# EAGLE design snes_ext_port_adapter (EAGLE 6.4)
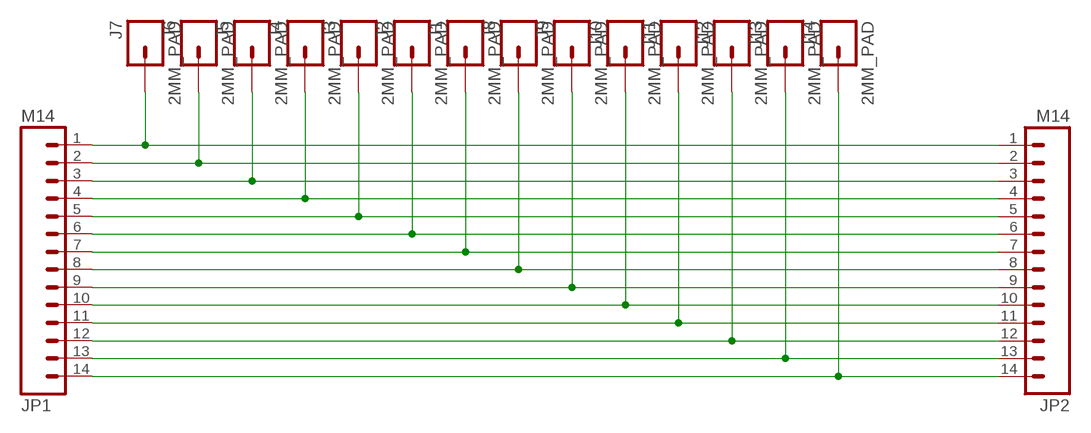
[diagram p0: schematic, sheet 1]

## Parts
J1  2MM_PAD  [1MM_PAD]
J2  2MM_PAD  [1MM_PAD]
J3  2MM_PAD  [1MM_PAD]
J4  2MM_PAD  [1MM_PAD]
J5  2MM_PAD  [1MM_PAD]
J6  2MM_PAD  [1MM_PAD]
J7  2MM_PAD  [1MM_PAD]
J8  2MM_PAD  [1MM_PAD]
J9  2MM_PAD  [1MM_PAD]
J10  2MM_PAD  [1MM_PAD]
J11  2MM_PAD  [1MM_PAD]
J12  2MM_PAD  [1MM_PAD]
J13  2MM_PAD  [1MM_PAD]
J14  2MM_PAD  [1MM_PAD]
JP1  M14  [1X14]
JP2  M14  [1X14]

## Nets
N$1: J7.P$1 JP1.1 JP2.1
N$2: J6.P$1 JP1.2 JP2.2
N$3: J5.P$1 JP1.3 JP2.3
N$4: J4.P$1 JP1.4 JP2.4
N$5: J3.P$1 JP1.5 JP2.5
N$6: J2.P$1 JP1.6 JP2.6
N$7: J1.P$1 JP1.7 JP2.7
N$8: J8.P$1 JP1.8 JP2.8
N$9: J9.P$1 JP1.9 JP2.9
N$10: J10.P$1 JP1.10 JP2.10
N$11: J11.P$1 JP1.11 JP2.11
N$12: J12.P$1 JP1.12 JP2.12
N$13: J13.P$1 JP1.13 JP2.13
N$14: J14.P$1 JP1.14 JP2.14

## Library data of the parts
J1-J14 = TASLink:2MM_PAD
JP1 JP2 = SparkFun-Connectors:M14: Header 14 Standard 14-pin 0.1" header. Use with straight break away headers (SKU : PRT-00116), right angle break away headers (PRT-00553), swiss pins (PRT-00743), machine pins (PRT-00117), and female headers (PRT-00115).

## Board
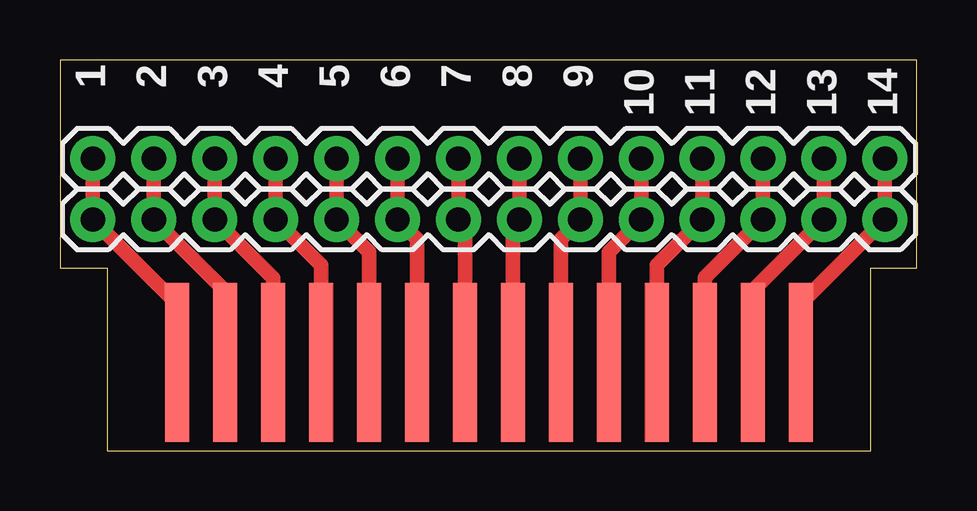
[diagram p1: board, top side]

Size 35.71 x 16.31 mm. Coordinates in mm from the lower left corner, seen from the top.
Outline: 1.97,0 33.8,0 33.8,7.62 35.71,7.62 35.71,16.31 0,16.31 0,7.62 1.97,7.62 1.97,0
Copper layers (1*16): Top 0.0356mm / dielectric 1.5011mm / Bottom 0.0356mm
Design rules "LaenPCBOrder": minimum track width 6mil, minimum drill 13mil, track to track 6mil, track to pad 6mil, pad to pad 6mil, via to via 6mil, smd to smd 6mil, copper to edge 15mil, drill to drill 6mil, minimum pad ring 7mil, minimum via ring 7mil, stop-mask expansion 3mil, vias tented up to drill 0mil, thermal gap 10mil

### Footprints (pad centres in the part's own frame; a part is rotated, then mirrored left to right if it is on the bottom)
1MM_PAD = smd 1 x 6.619: P$1 0,0
1X14 = drill 1.016 pad 1.88: 1 0,0; 2 2.54,0; 3 5.08,0; 4 7.62,0; 5 10.16,0; 6 12.7,0; 7 15.24,0; 8 17.78,0; 9 20.32,0; 10 22.86,0; 11 25.4,0; 12 27.94,0; 13 30.48,0; 14 33.02,0

### Placement (x,y rotation side)
J1  16.88,3.69 0 top
J2  14.88,3.69 0 top
J3  12.88,3.69 0 top
J4  10.88,3.69 0 top
J5  8.88,3.69 0 top
J6  6.88,3.69 0 top
J7  4.88,3.69 0 top
J8  18.88,3.69 0 top
J9  20.88,3.69 0 top
J10  22.88,3.69 0 top
J11  24.88,3.69 0 top
J12  26.88,3.69 0 top
J13  28.88,3.69 0 top
J14  30.88,3.69 0 top
JP1  1.37,12.19 0 top
JP2  1.37,9.65 0 top

### Tracks (layer width: path | path; a pad name or v marks a point on that pad's centre or on a via)
N$1
  Top 0.61: JP1.1 JP2.1 4.88,6.14 J7.P$1
N$2
  Top 0.61: JP1.2 JP2.2 6.88,6.68 J6.P$1
N$3
  Top 0.61: JP1.3 JP2.3 8.88,7.22 J5.P$1
N$4
  Top 0.61: JP1.4 JP2.4 10.88,7.76 J4.P$1
N$5
  Top 0.61: JP1.5 JP2.5 12.88,8.3 J3.P$1
N$6
  Top 0.61: JP1.6 JP2.6 14.88,8.84 J2.P$1
N$7
  Top 0.61: JP1.7 JP2.7 16.88,9.38 J1.P$1
N$8
  Top 0.61: JP1.8 JP2.8 18.88,9.38 J8.P$1
N$9
  Top 0.61: JP1.9 JP2.9 20.88,8.84 J9.P$1
N$10
  Top 0.61: JP1.10 JP2.10 22.88,8.3 J10.P$1
N$11
  Top 0.61: JP1.11 JP2.11 24.88,7.76 J11.P$1
N$12
  Top 0.61: JP1.12 JP2.12 26.88,7.22 J12.P$1
N$13
  Top 0.61: JP1.13 JP2.13 28.88,6.68 J13.P$1
N$14
  Top 0.61: JP1.14 JP2.14 30.88,6.14 J14.P$1

### Text on the board
tPlace: 1 | 2 | 3 | 4 | 5 | 6 | 7 | 8 | 9 | 10 | 11 | 12 | 13 | 14